# Altium schematic sheet Drivers.SchDoc: =DocumentName
size A3; DocumentNumber: 1; Revision: 0; SheetNumber: 14; SheetTotal: 15; Last modified by: Krzysztof Belewicz
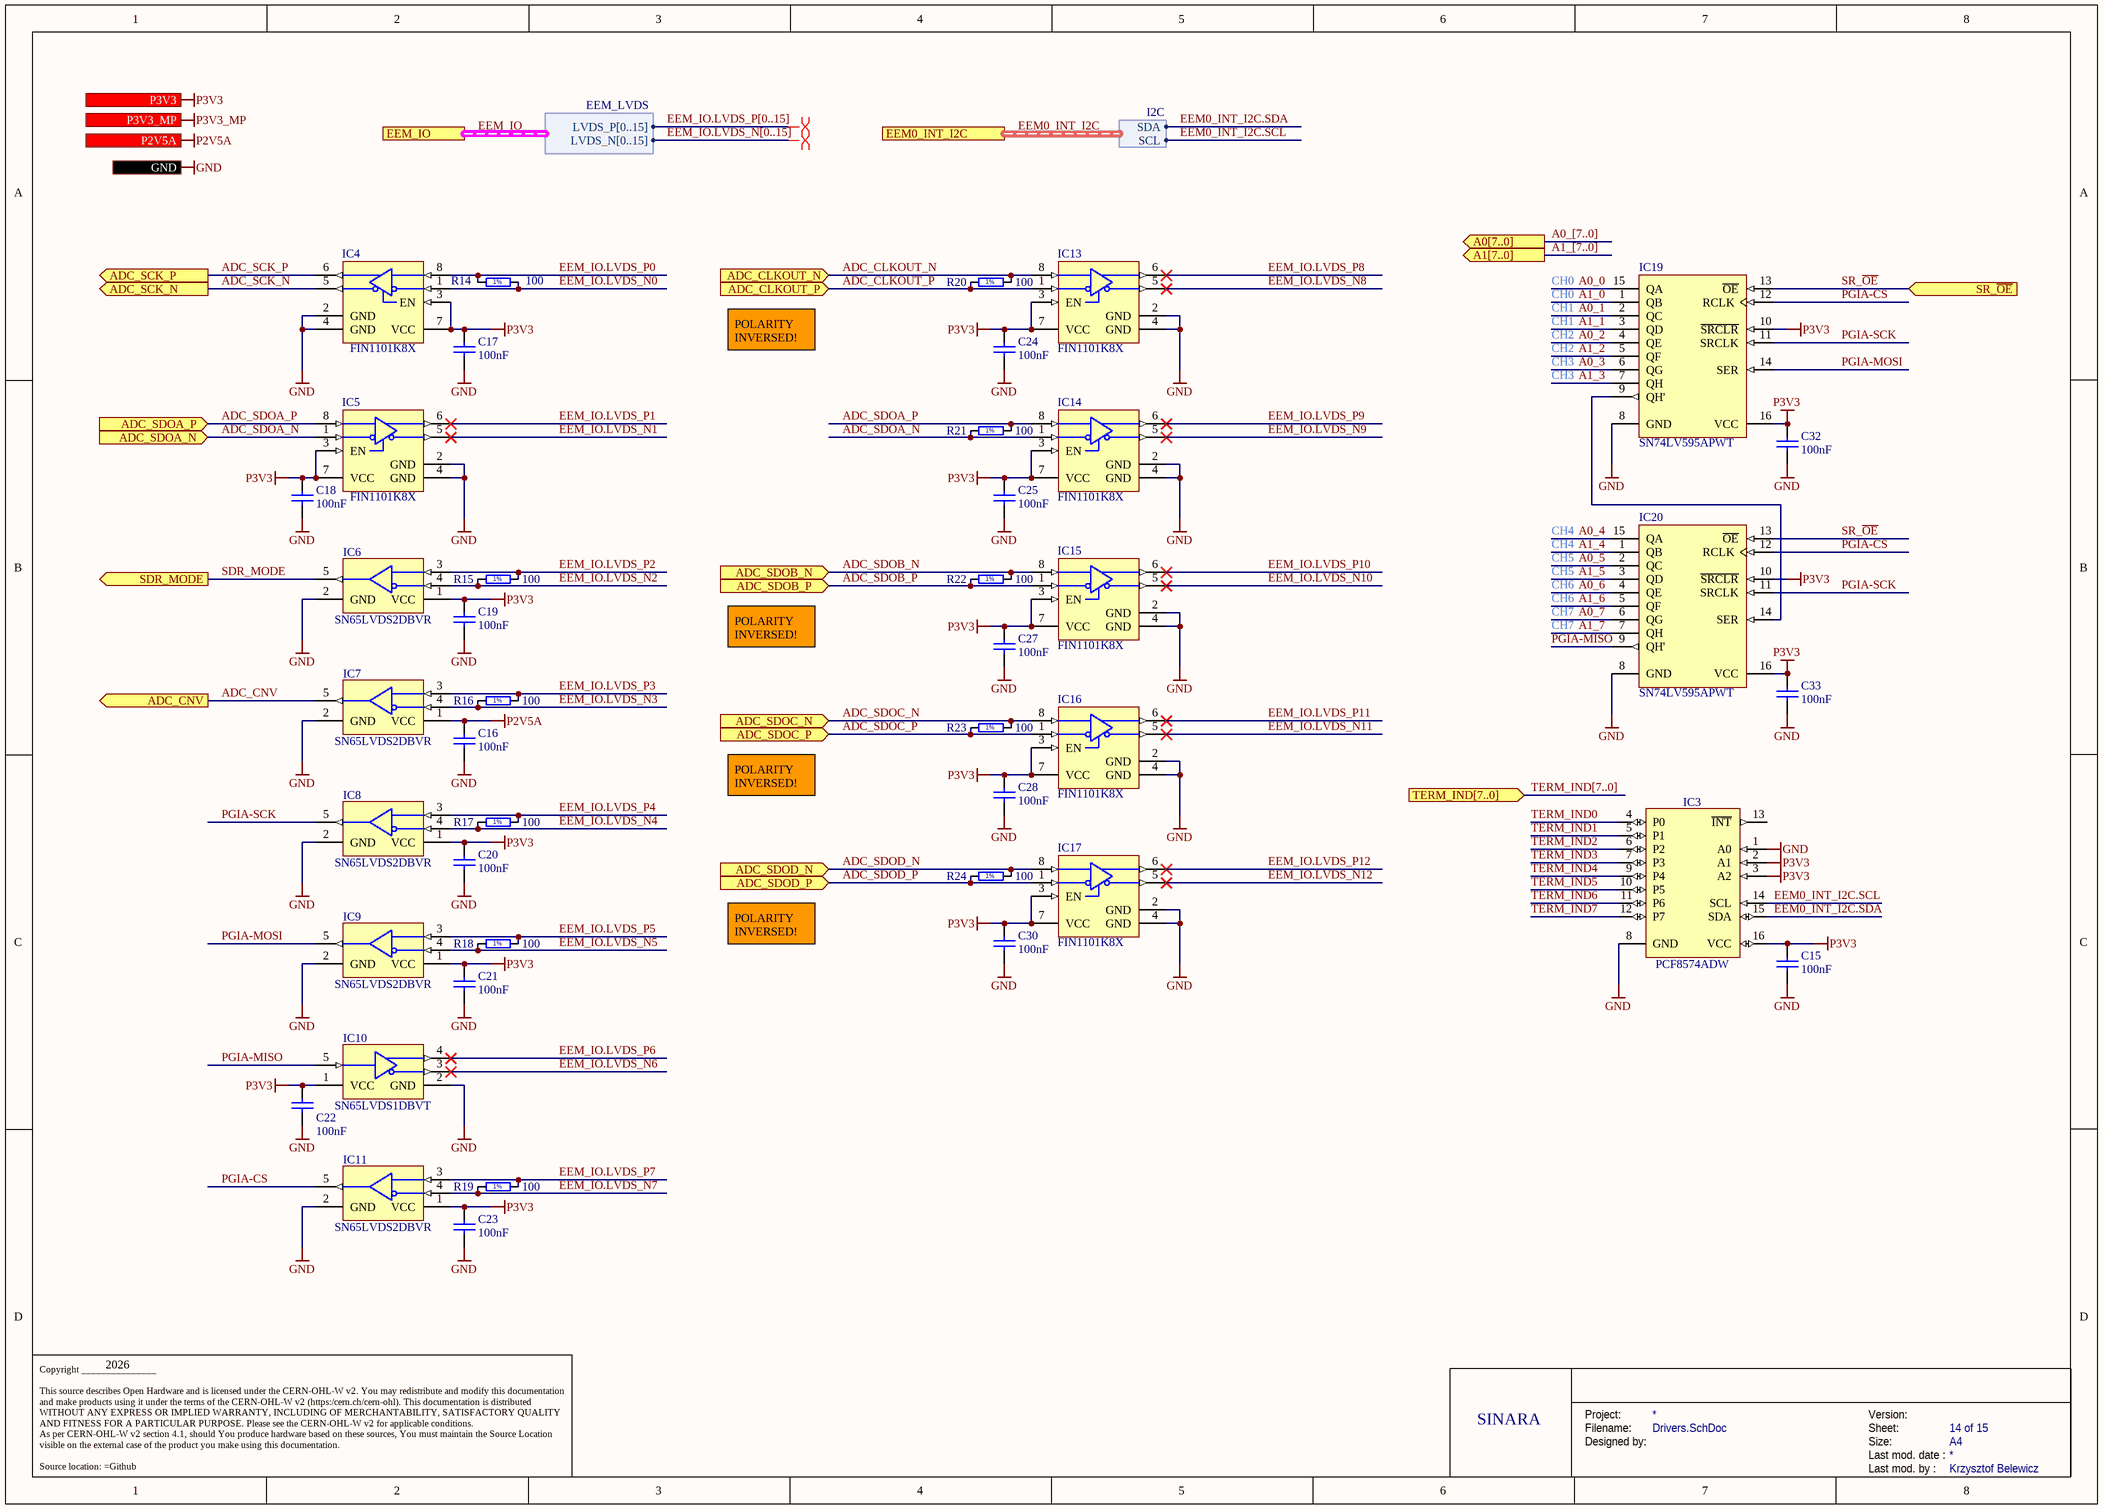
[diagram p0: Drivers.SchDoc]

## Parts
C15  100nF  [CAPC1005X55N]
C16  100nF  [CAPC1005X55N]
C17  100nF  [CAPC1005X55N]
C18  100nF  [CAPC1005X55N]
C19  100nF  [CAPC1005X55N]
C20  100nF  [CAPC1005X55N]
C21  100nF  [CAPC1005X55N]
C22  100nF  [CAPC1005X55N]
C23  100nF  [CAPC1005X55N]
C24  100nF  [CAPC1005X55N]
C25  100nF  [CAPC1005X55N]
C27  100nF  [CAPC1005X55N]
C28  100nF  [CAPC1005X55N]
C30  100nF  [CAPC1005X55N]
C32  100nF  [CAPC1005X55N]
C33  100nF  [CAPC1005X55N]
IC3  PCF8574ADW  [SOIC127P1030X265-16N]
IC4  FIN1101K8X  [SOP50P310X90-8N]
IC5  FIN1101K8X  [SOP50P310X90-8N]
IC6  SN65LVDS2DBVR  [SOT95P280X145-5N]
IC7  SN65LVDS2DBVR  [SOT95P280X145-5N]
IC8  SN65LVDS2DBVR  [SOT95P280X145-5N]
IC9  SN65LVDS2DBVR  [SOT95P280X145-5N]
IC10  SN65LVDS1DBVT  [SOT95P280X145-5N]
IC11  SN65LVDS2DBVR  [SOT95P280X145-5N]
IC13  FIN1101K8X  [SOP50P310X90-8N]
IC14  FIN1101K8X  [SOP50P310X90-8N]
IC15  FIN1101K8X  [SOP50P310X90-8N]
IC16  FIN1101K8X  [SOP50P310X90-8N]
IC17  FIN1101K8X  [SOP50P310X90-8N]
IC19  SN74LV595APWT  [SOP65P640X120-16N]
IC20  SN74LV595APWT  [SOP65P640X120-16N]
R14  100  [RESC1005X40N]
R15  100  [RESC1005X40N]
R16  100  [RESC1005X40N]
R17  100  [RESC1005X40N]
R18  100  [RESC1005X40N]
R19  100  [RESC1005X40N]
R20  100  [RESC1005X40N]
R21  100  [RESC1005X40N]
R22  100  [RESC1005X40N]
R23  100  [RESC1005X40N]
R24  100  [RESC1005X40N]

## Ports
A0[7..0] (out), A1[7..0] (out), ADC_CLKOUT_N (in), ADC_CLKOUT_P (in), ADC_CNV (out), ADC_SCK_N (out), ADC_SCK_P (out), ADC_SDOA_N (in), ADC_SDOA_P (in), ADC_SDOB_N (in), ADC_SDOB_P (in), ADC_SDOC_N (in), ADC_SDOC_P (in), ADC_SDOD_N (in), ADC_SDOD_P (in), EEM0_INT_I2C (harness I2C), EEM_IO (harness EEM_LVDS), GND, P2V5A (in), P3V3 (in), P3V3_MP (in), SDR_MODE (out), SR_~{OE} (in), TERM_IND[7..0] (in)

## Harnesses
EEM_LVDS: LVDS_P[0..15], LVDS_N[0..15]
I2C: SDA, SCL

## Nets
GND: C15.1 C16.1 C17.1 C18.1 C19.1 C20.1 C21.1 C22.1 C23.1 C24.1 C25.1 C27.1 C28.1 C30.1 C32.1 C33.1 IC3.1(A0) IC3.8(GND) IC4.2(GND) IC4.4(GND) IC5.2(GND) IC5.4(GND) IC6.2(GND) IC7.2(GND) IC8.2(GND) IC9.2(GND) IC10.2(GND) IC11.2(GND) IC13.2(GND) IC13.4(GND) IC14.2(GND) IC14.4(GND) IC15.2(GND) IC15.4(GND) IC16.2(GND) IC16.4(GND) IC17.2(GND) IC17.4(GND) IC19.8(GND) IC20.8(GND) ; port GND
P2V5A: C16.2 IC7.1(VCC) ; port P2V5A
P3V3: C15.2 C17.2 C18.2 C19.2 C20.2 C21.2 C22.2 C23.2 C24.2 C25.2 C27.2 C28.2 C30.2 C32.2 C33.2 IC3.2(A1) IC3.3(A2) IC3.16(VCC) IC4.3(EN) IC4.7(VCC) IC5.3(EN) IC5.7(VCC) IC6.1(VCC) IC8.1(VCC) IC9.1(VCC) IC10.1(VCC) IC11.1(VCC) IC13.3(EN) IC13.7(VCC) IC14.3(EN) IC14.7(VCC) IC15.3(EN) IC15.7(VCC) IC16.3(EN) IC16.7(VCC) IC17.3(EN) IC17.7(VCC) IC19.10(~{SRCLR}) IC19.16(VCC) IC20.10(~{SRCLR}) IC20.16(VCC) ; port P3V3
P3V3_MP: port P3V3_MP
A0_0: IC19.15(QA)
A0_1: IC19.2(QC)
A0_2: IC19.4(QE)
A0_3: IC19.6(QG)
A0_4: IC20.15(QA)
A0_5: IC20.2(QC)
A0_6: IC20.4(QE)
A0_7: IC20.6(QG)
A1_0: IC19.1(QB)
A1_1: IC19.3(QD)
A1_2: IC19.5(QF)
A1_3: IC19.7(QH)
A1_4: IC20.1(QB)
A1_5: IC20.3(QD)
A1_6: IC20.5(QF)
A1_7: IC20.7(QH)
ADC_CLKOUT_N: IC13.8(RIN+) R20.2 ; port ADC_CLKOUT_N
ADC_CLKOUT_P: IC13.1(RIN-) R20.1 ; port ADC_CLKOUT_P
ADC_CNV: IC7.5(R) ; port ADC_CNV
ADC_SCK_N: IC4.5(DOUT-) ; port ADC_SCK_N
ADC_SCK_P: IC4.6(DOUT+) ; port ADC_SCK_P
ADC_SDOA_N: IC5.1(RIN-) IC14.1(RIN-) R21.1 ; port ADC_SDOA_N
ADC_SDOA_P: IC5.8(RIN+) IC14.8(RIN+) R21.2 ; port ADC_SDOA_P
ADC_SDOB_N: IC15.8(RIN+) R22.2 ; port ADC_SDOB_N
ADC_SDOB_P: IC15.1(RIN-) R22.1 ; port ADC_SDOB_P
ADC_SDOC_N: IC16.8(RIN+) R23.2 ; port ADC_SDOC_N
ADC_SDOC_P: IC16.1(RIN-) R23.1 ; port ADC_SDOC_P
ADC_SDOD_N: IC17.8(RIN+) R24.2 ; port ADC_SDOD_N
ADC_SDOD_P: IC17.1(RIN-) R24.1 ; port ADC_SDOD_P
EEM0_INT_I2C.SCL: IC3.14(SCL) ; port EEM0_INT_I2C.SCL
EEM0_INT_I2C.SDA: IC3.15(SDA) ; port EEM0_INT_I2C.SDA
EEM_IO.LVDS_N0: IC4.1(RIN-) R14.1
EEM_IO.LVDS_N1: IC5.5(DOUT-)
EEM_IO.LVDS_N2: IC6.4(B) R15.1
EEM_IO.LVDS_N3: IC7.4(B) R16.1
EEM_IO.LVDS_N4: IC8.4(B) R17.1
EEM_IO.LVDS_N5: IC9.4(B) R18.1
EEM_IO.LVDS_N6: IC10.3(A)
EEM_IO.LVDS_N7: IC11.4(B) R19.1
EEM_IO.LVDS_N8: IC13.5(DOUT-)
EEM_IO.LVDS_N9: IC14.5(DOUT-)
EEM_IO.LVDS_N10: IC15.5(DOUT-)
EEM_IO.LVDS_N11: IC16.5(DOUT-)
EEM_IO.LVDS_N12: IC17.5(DOUT-)
EEM_IO.LVDS_P0: IC4.8(RIN+) R14.2
EEM_IO.LVDS_P1: IC5.6(DOUT+)
EEM_IO.LVDS_P2: IC6.3(A) R15.2
EEM_IO.LVDS_P3: IC7.3(A) R16.2
EEM_IO.LVDS_P4: IC8.3(A) R17.2
EEM_IO.LVDS_P5: IC9.3(A) R18.2
EEM_IO.LVDS_P6: IC10.4(B)
EEM_IO.LVDS_P7: IC11.3(A) R19.2
EEM_IO.LVDS_P8: IC13.6(DOUT+)
EEM_IO.LVDS_P9: IC14.6(DOUT+)
EEM_IO.LVDS_P10: IC15.6(DOUT+)
EEM_IO.LVDS_P11: IC16.6(DOUT+)
EEM_IO.LVDS_P12: IC17.6(DOUT+)
PGIA-CS: IC11.5(R) IC19.12(RCLK) IC20.12(RCLK)
PGIA-MISO: IC10.5(R) IC20.9(QH')
PGIA-MOSI: IC9.5(R) IC19.14(SER)
PGIA-SCK: IC8.5(R) IC19.11(SRCLK) IC20.11(SRCLK)
SDR_MODE: IC6.5(R) ; port SDR_MODE
SR_~{OE}: IC19.13(~{OE}) IC20.13(~{OE}) ; port SR_~{OE}
TERM_IND0: IC3.4(P0)
TERM_IND1: IC3.5(P1)
TERM_IND2: IC3.6(P2)
TERM_IND3: IC3.7(P3)
TERM_IND4: IC3.9(P4)
TERM_IND5: IC3.10(P5)
TERM_IND6: IC3.11(P6)
TERM_IND7: IC3.12(P7)
NetIC19_9: IC19.9(QH') IC20.14(SER)

Not connected (* = marked no-connect by the designer): IC3 13(~{INT})

## Buses and harness runs
bus A0_[7..0] = port A0[7..0]
bus A1_[7..0] = port A1[7..0]
bus EEM_IO.LVDS_N[0..15]
bus EEM_IO.LVDS_P[0..15]
bus TERM_IND[7..0] = port TERM_IND[7..0]
harness EEM0_INT_I2C = port EEM0_INT_I2C
harness EEM_IO = port EEM_IO

## Layout directives
differential pair; differential pair class Diff_100Ohm: (no net found under the mark)

## Notes on the sheet
- CH0
- CH1
- POLARITY INVERSED!
- CH2
- CH3
- CH4
- CH5
- CH6
- CH7
- 2026
- SINARA
- Project:
- Designed by:
- Filename:
- Size:
- Version:
- Last mod. date :
- Sheet:
- A4
- Copyright _______________
  This source describes Open Hardware and is licensed under the CERN-OHL-W v2. You may redistribute and modify this documentation and make products using it under the terms of the CERN-OHL-W v2 (https:/cern.ch/cern-ohl). This documentation is distributed WITHOUT ANY EXPRESS OR IMPLIED WARRANTY, INCLUDING OF MERCHANTABILITY, SATISFACTORY QUALITY AND FITNESS FOR A PARTICULAR PURPOSE. Please see the CERN-OHL-W v2 for applicable conditions.
  As per CERN-OHL-W v2 section 4.1, should You produce hardware based on these sources, You must maintain the Source Location visible on the external case of the product you make using this documentation.
  Source location: =Github
- Last mod. by :
- (in symbol R0402_100R_1%_0.1W_100PPM) 1%

## Library data of the parts
C15-C25 C27 C28 C30 C32 C33 = CC0402_100NF_50V_10%_X7R: Non-polarised capacitor; Part Description: SMD Multilayer Chip Ceramic Capacitor; Manufacturer: GENERIC; Manufacturer1 Part Number: GRM155R71H104KE14D; Voltage: 50V; TC: X7R; Tolerance: ±10%; Part Number: CC0402_100NF_50V_10%_X7R; Component Kind: Standard; Component Type: Standard; Pin Count: 2; Value: 100nF; Status: None; Manufacturer Part Number: CC0402_100NF_50V_10%_X7R; Case: 0402; Mounted: Yes; Socket: No; SMD: Yes; Sense: No; Manufacturer1 Example: MURATA; Manufacturer1 ComponentHeight: 0.55mm; HelpURL: \\cern.ch\dfs\Applications\Altium\Datasheets\CC0402_MURATA_GRM155R71H104KE14D.pdf; Author: CERN DEM MR; CreateDate: 30.06.2017; LatestRevisionDate: 30.06.2017
IC3 = PCF8574ADW: Remote 8-bit I/O Expander For I2C Bus; Manufacturer: TEXAS INSTRUMENTS; PressFit: No; Bonding: No; Part Number: PCF8574ADW; Component Kind: Standard; Component Type: Standard; Device: PCF8574ADW; PackageDescription: SOIC 16, Pitch 1.27mm - Body 7.5x10.3mm, IPC Medium Density; Part Description: Remote 8-bit I/O Expander For I2C Bus; Manufacturer Part Number: PCF8574ADW; Pin Count: 16; Case: SOIC16W; Mounted: Yes; Socket: No; SMD: Yes; Sense: No; ComponentHeight: 2.65mm; Author: CERN DEM JLC; HelpURL: \\cern.ch\dfs\Applications\Altium\Datasheets\PCF8574ADW.pdf; CreateDate: 01.11.2012; LatestRevisionDate: 01.11.2012
IC4 IC5 IC13-IC17 = FIN1101K8X: LVDS Single Port High Speed Repeater; Manufacturer: FAIRCHILD SEMICONDUCTOR; PressFit: No; Bonding: No; Part Number: FIN1101K8X; Component Kind: Standard; Component Type: Standard; Device: FIN1101K8X; PackageDescription: SOP, 0.50mm Pitch; 8 pin, 2.30mm W X 2.00mm L X 0.90mm H body, PC Medium Density; Part Description: LVDS Single Port High Speed Repeater; Manufacturer Part Number: FIN1101K8X; Pin Count: 8; Case: TSSOP8; Mounted: Yes; Socket: No; SMD: Yes; Sense: No; ComponentHeight: 0.8mm; Author: CERN DEM JLC; HelpURL: \\cern.ch\dfs\Applications\Altium\Datasheets\FIN1101K8X.pdf; CreateDate: 08.11.2016; LatestRevisionDate: 08.11.2016
IC6-IC9 IC11 = SN65LVDS2DBVR: High-Speed Differential Line Receiver; Manufacturer: TEXAS INSTRUMENTS; PressFit: No; Bonding: No; Part Number: SN65LVDS2DBVR; Component Kind: Standard; Component Type: Standard; Device: SN65LVDS2DBVR; PackageDescription: SOT, 0.95mm pitch; 5 pin, 1.60mm W X 2.90mm L X 1.45mm H body, IPC Medium Density; Part Description: High-Speed Differential Line Receiver; Manufacturer Part Number: SN65LVDS2DBVR; Pin Count: 5; Case: SOT23-5; Mounted: Yes; Socket: No; SMD: Yes; Sense: No; ComponentHeight: 1.45mm; Author: CERN DEM JLC; HelpURL: \\cern.ch\dfs\Applications\Altium\Datasheets\SN65LVDS2DBVR.pdf; CreateDate: 03.03.2011; LatestRevisionDate: 22.09.2011
IC10 = SN65LVDS1DBVT: High-Speed Differential Line Driver; Manufacturer: TEXAS INSTRUMENTS; PressFit: No; Bonding: No; Part Number: SN65LVDS1DBVT; Component Kind: Standard; Component Type: Standard; Device: SN65LVDS1DBVT; PackageDescription: SOT, 0.95mm pitch; 5 pin, 1.60mm W X 2.90mm L X 1.45mm H body, IPC Medium Density; Part Description: High-Speed Differential Line Driver; Manufacturer Part Number: SN65LVDS1DBVT; Pin Count: 5; Case: SOT23-5; Mounted: Yes; Socket: No; SMD: Yes; Sense: No; ComponentHeight: 1.45mm; Author: CERN DEM JLC; HelpURL: \\cern.ch\dfs\Applications\Altium\Datasheets\SN65LVDS1DBVT.pdf; CreateDate: 22.09.2011; LatestRevisionDate: 22.09.2011
IC19 IC20 = SN74LV595APWT: 8-Bit Shift Register With 3-State Output Register; Manufacturer: TEXAS INSTRUMENTS; PressFit: No; Bonding: No; Part Number: SN74LV595APWT; Component Kind: Standard; Component Type: Standard; Device: SN74LV595APWT; PackageDescription: SOP, 0.65mm pitch; 16 pin, 4.40mm W X 5.00mm L X 1.20mm H body IPC Medium Density; Part Description: 8-Bit Shift Register With 3-State Output Register; Manufacturer Part Number: SN74LV595APWT; Pin Count: 16; Case: TSSOP16; Mounted: Yes; Socket: No; SMD: Yes; Sense: No; ComponentHeight: 1.2mm; Author: CERN DEM JLC; HelpURL: \\cern.ch\dfs\Applications\Altium\Datasheets\SN74LV595APWT.pdf; CreateDate: 10.05.2012; LatestRevisionDate: 10.05.2012
R14-R24 = R0402_100R_1%_0.1W_100PPM: Resistor - 1%; Part Description: General Purpose Thick Film Chip Resistor; Manufacturer: GENERIC; Manufacturer Part Number: R0402_100R_1%_0.1W_100PPM_50V; Manufacturer1 Part Number: ERJ2RKF1000X; Power: 0.1W; TC: ±100ppm/°C; Voltage: 50V; Part Number: R0402_100R_1%_0.1W_100PPM; Component Kind: Standard; Component Type: Standard; Pin Count: 2; Value: 100; Status: Not recommended; Tolerance: ±1%; Case: 0402; Mounted: Yes; Sense: No; Socket: No; SMD: Yes; Manufacturer1 Example: PANASONIC; Manufacturer1 ComponentHeight: 0.4mm; HelpURL: \\cern.ch\dfs\Applications\Altium\Datasheets\R0402_PANASONIC_ERJ2RK.pdf; Author: CERN DEM JLC; CreateDate: 12.12.2013; LatestRevisionDate: 03.03.2015